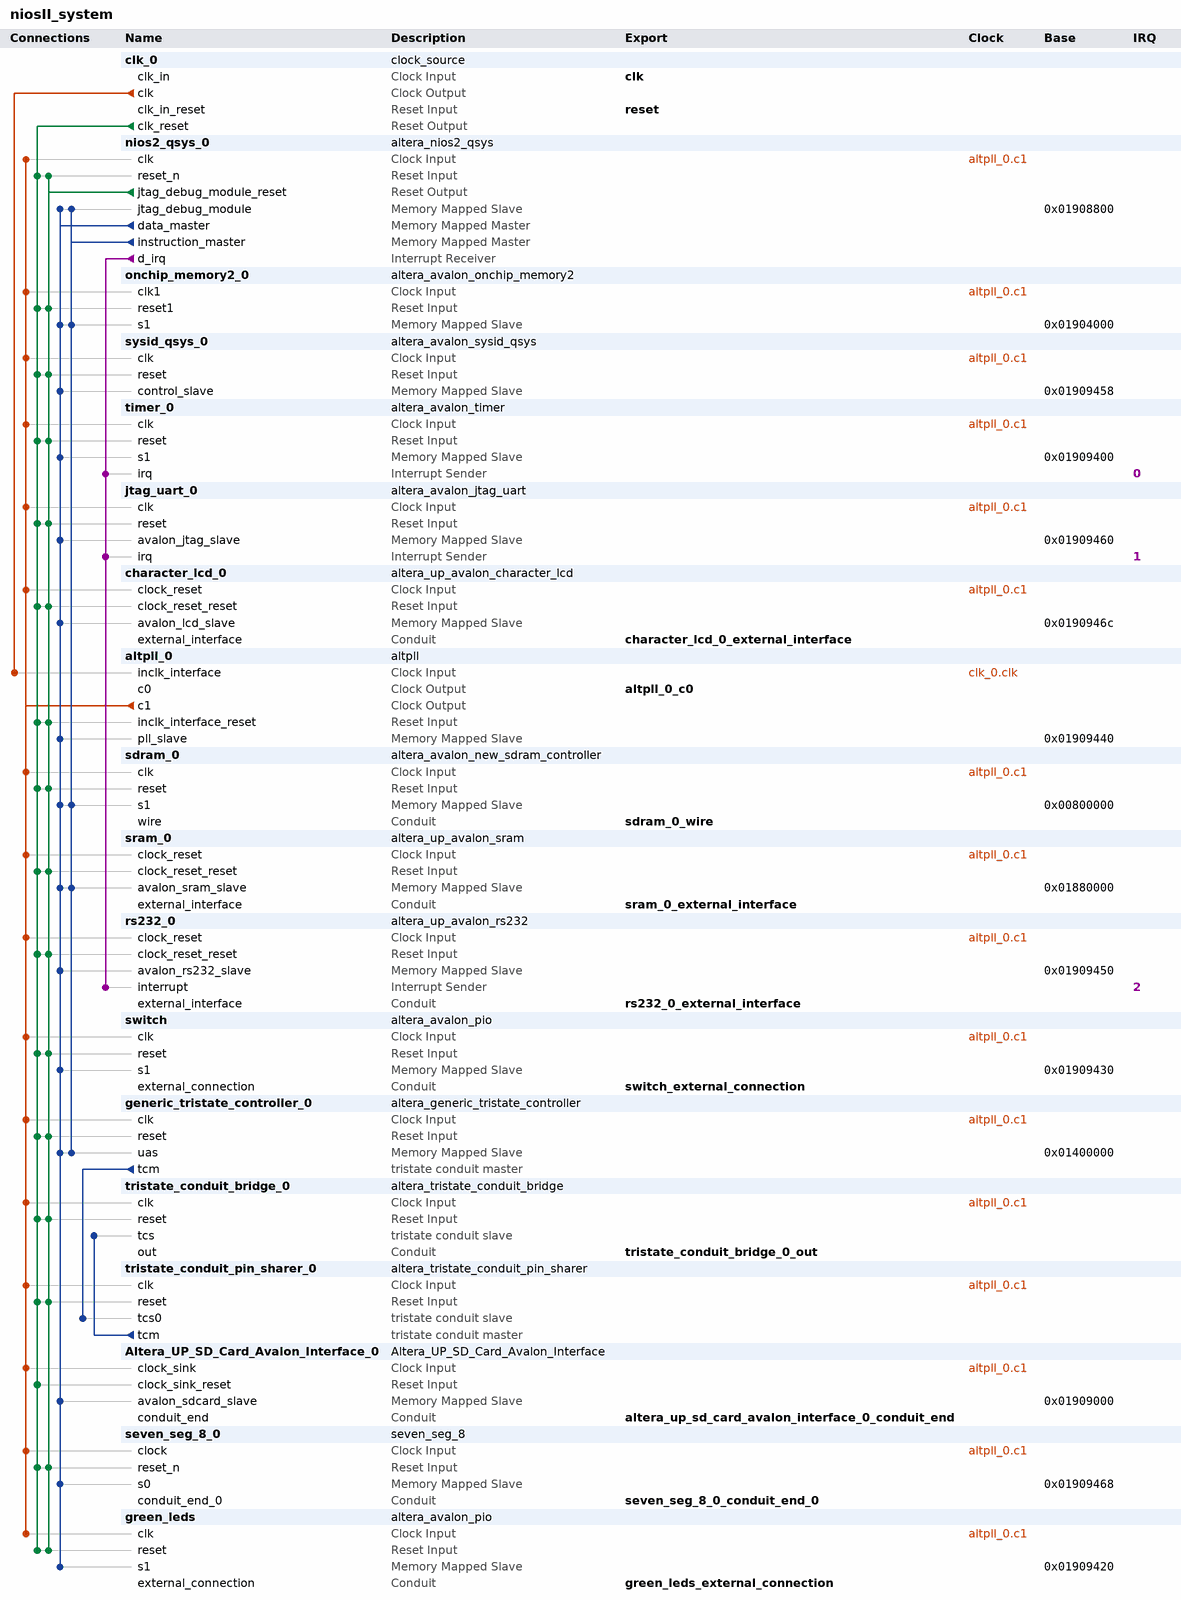
[diagram p0: system contents]
# Platform Designer (Qsys) system niosII_system, Cyclone II EP2C35F672C6
# Parameters at their usual value, and those the tool derives, are not listed.
package require -exact qsys 12.1
create_system niosII_system
set_project_property DEVICE_FAMILY {Cyclone II}
set_project_property DEVICE EP2C35F672C6

add_instance clk_0 clock_source 12.1
set_instance_parameter_value clk_0 clockFrequency 50000000

add_instance nios2_qsys_0 altera_nios2_qsys 12.1
set_instance_parameter_value nios2_qsys_0 resetSlave onchip_memory2_0.s1
set_instance_parameter_value nios2_qsys_0 exceptionSlave onchip_memory2_0.s1
set_instance_parameter_value nios2_qsys_0 breakSlave nios2_qsys_0.jtag_debug_module
set_instance_parameter_value nios2_qsys_0 impl Tiny
set_instance_parameter_value nios2_qsys_0 icache_size 4096

add_instance onchip_memory2_0 altera_avalon_onchip_memory2 12.1
set_instance_parameter_value onchip_memory2_0 dataWidth 32
set_instance_parameter_value onchip_memory2_0 dualPort false
set_instance_parameter_value onchip_memory2_0 initMemContent true
set_instance_parameter_value onchip_memory2_0 initializationFileName onchip_memory2_0
set_instance_parameter_value onchip_memory2_0 memorySize 16384

add_instance sysid_qsys_0 altera_avalon_sysid_qsys 12.1
set_instance_parameter_value sysid_qsys_0 id 0

add_instance timer_0 altera_avalon_timer 12.1
set_instance_parameter_value timer_0 period 1
set_instance_parameter_value timer_0 periodUnits MSEC
set_instance_parameter_value timer_0 timerPreset CUSTOM

add_instance jtag_uart_0 altera_avalon_jtag_uart 12.1
set_instance_parameter_value jtag_uart_0 simInteractiveOptions INTERACTIVE_INPUT_OUTPUT

add_instance character_lcd_0 altera_up_avalon_character_lcd 12.0
set_instance_parameter_value character_lcd_0 cursor Normal

add_instance altpll_0 altpll 12.1
set_instance_parameter_value altpll_0 INCLK0_INPUT_FREQUENCY 20000
set_instance_parameter_value altpll_0 COMPENSATE_CLOCK CLK1
set_instance_parameter_value altpll_0 GATE_LOCK_SIGNAL NO
set_instance_parameter_value altpll_0 VALID_LOCK_MULTIPLIER 1
set_instance_parameter_value altpll_0 INVALID_LOCK_MULTIPLIER 5
set_instance_parameter_value altpll_0 CLK0_MULTIPLY_BY 8
set_instance_parameter_value altpll_0 CLK1_MULTIPLY_BY 8
set_instance_parameter_value altpll_0 CLK0_DIVIDE_BY 5
set_instance_parameter_value altpll_0 CLK1_DIVIDE_BY 5
set_instance_parameter_value altpll_0 CLK0_PHASE_SHIFT -3000
set_instance_parameter_value altpll_0 CLK1_PHASE_SHIFT 0
set_instance_parameter_value altpll_0 CLK1_DUTY_CYCLE 50
set_instance_parameter_value altpll_0 PORT_clk1 PORT_USED
set_instance_parameter_value altpll_0 PORT_clk2 PORT_UNUSED
set_instance_parameter_value altpll_0 PORT_clk3 PORT_UNUSED
set_instance_parameter_value altpll_0 PORT_ARESET PORT_UNUSED
set_instance_parameter_value altpll_0 PORT_LOCKED PORT_UNUSED

add_instance sdram_0 altera_avalon_new_sdram_controller 12.1
set_instance_parameter_value sdram_0 TAC 5.5
set_instance_parameter_value sdram_0 TRCD 20.0
set_instance_parameter_value sdram_0 TRP 20.0
set_instance_parameter_value sdram_0 casLatency 3
set_instance_parameter_value sdram_0 columnWidth 8
set_instance_parameter_value sdram_0 dataWidth 16
set_instance_parameter_value sdram_0 generateSimulationModel false
set_instance_parameter_value sdram_0 model custom
set_instance_parameter_value sdram_0 numberOfBanks 4
set_instance_parameter_value sdram_0 numberOfChipSelects 1
set_instance_parameter_value sdram_0 powerUpDelay 100.0
set_instance_parameter_value sdram_0 refreshPeriod 15.625
set_instance_parameter_value sdram_0 rowWidth 12

add_instance sram_0 altera_up_avalon_sram 12.0
set_instance_parameter_value sram_0 board DE2
set_instance_parameter_value sram_0 pixel_buffer false

add_instance rs232_0 altera_up_avalon_rs232 12.0
set_instance_parameter_value rs232_0 baud 57600
set_instance_parameter_value rs232_0 parity None

add_instance switch altera_avalon_pio 12.1
set_instance_parameter_value switch direction Input
set_instance_parameter_value switch width 1

add_instance generic_tristate_controller_0 altera_generic_tristate_controller 12.1
set_instance_parameter_value generic_tristate_controller_0 TCM_ADDRESS_W 22
set_instance_parameter_value generic_tristate_controller_0 TCM_DATA_W 8
set_instance_parameter_value generic_tristate_controller_0 TCM_BYTEENABLE_W 1
set_instance_parameter_value generic_tristate_controller_0 TCM_READ_WAIT 160
set_instance_parameter_value generic_tristate_controller_0 TCM_WRITE_WAIT 160
set_instance_parameter_value generic_tristate_controller_0 TCM_SETUP_WAIT 40
set_instance_parameter_value generic_tristate_controller_0 TCM_DATA_HOLD 40
set_instance_parameter_value generic_tristate_controller_0 TCM_MAX_PENDING_READ_TRANSACTIONS 3
set_instance_parameter_value generic_tristate_controller_0 TCM_TURNAROUND_TIME 2
set_instance_parameter_value generic_tristate_controller_0 TCM_TIMING_UNITS 0
set_instance_parameter_value generic_tristate_controller_0 TCM_READLATENCY 2
set_instance_parameter_value generic_tristate_controller_0 TCM_SYMBOLS_PER_WORD 1
set_instance_parameter_value generic_tristate_controller_0 USE_READ 1
set_instance_parameter_value generic_tristate_controller_0 USE_BEGINTRANSFER 0
set_instance_parameter_value generic_tristate_controller_0 USE_BYTEENABLE 0
set_instance_parameter_value generic_tristate_controller_0 USE_OUTPUTENABLE 0
set_instance_parameter_value generic_tristate_controller_0 ACTIVE_LOW_READ 1
set_instance_parameter_value generic_tristate_controller_0 ACTIVE_LOW_BYTEENABLE 0
set_instance_parameter_value generic_tristate_controller_0 ACTIVE_LOW_OUTPUTENABLE 0
set_instance_parameter_value generic_tristate_controller_0 ACTIVE_LOW_BEGINTRANSFER 0
set_instance_parameter_value generic_tristate_controller_0 CHIPSELECT_THROUGH_READLATENCY 0
set_instance_parameter_value generic_tristate_controller_0 MODULE_ASSIGNMENT_KEYS embeddedsw.configuration.hwClassnameDriverSupportList,embeddedsw.configuration.isFlash,embeddedsw.configuration.isMemoryDevice,embeddedsw.configuration.isNonVolatileStorage
set_instance_parameter_value generic_tristate_controller_0 MODULE_ASSIGNMENT_VALUES "altera_avalon_lan91c111\\,altera_avalon_cfi_flash,1,1,1"

add_instance tristate_conduit_bridge_0 altera_tristate_conduit_bridge 12.1

add_instance tristate_conduit_pin_sharer_0 altera_tristate_conduit_pin_sharer 12.1
set_instance_parameter_value tristate_conduit_pin_sharer_0 NUM_INTERFACES 1

add_instance Altera_UP_SD_Card_Avalon_Interface_0 Altera_UP_SD_Card_Avalon_Interface 1.0

add_instance seven_seg_8_0 seven_seg_8 1.0

add_instance green_leds altera_avalon_pio 12.1
set_instance_parameter_value green_leds direction Output
set_instance_parameter_value green_leds width 8

# connections
add_connection altpll_0.c1 Altera_UP_SD_Card_Avalon_Interface_0.clock_sink clock
add_connection altpll_0.c1 character_lcd_0.clock_reset clock
add_connection altpll_0.c1 generic_tristate_controller_0.clk clock
add_connection altpll_0.c1 green_leds.clk clock
add_connection altpll_0.c1 jtag_uart_0.clk clock
add_connection altpll_0.c1 nios2_qsys_0.clk clock
add_connection altpll_0.c1 onchip_memory2_0.clk1 clock
add_connection altpll_0.c1 rs232_0.clock_reset clock
add_connection altpll_0.c1 sdram_0.clk clock
add_connection altpll_0.c1 seven_seg_8_0.clock clock
add_connection altpll_0.c1 sram_0.clock_reset clock
add_connection altpll_0.c1 switch.clk clock
add_connection altpll_0.c1 sysid_qsys_0.clk clock
add_connection altpll_0.c1 timer_0.clk clock
add_connection altpll_0.c1 tristate_conduit_bridge_0.clk clock
add_connection altpll_0.c1 tristate_conduit_pin_sharer_0.clk clock
add_connection clk_0.clk altpll_0.inclk_interface clock
add_connection clk_0.clk_reset Altera_UP_SD_Card_Avalon_Interface_0.clock_sink_reset reset
add_connection clk_0.clk_reset altpll_0.inclk_interface_reset reset
add_connection clk_0.clk_reset character_lcd_0.clock_reset_reset reset
add_connection clk_0.clk_reset generic_tristate_controller_0.reset reset
add_connection clk_0.clk_reset green_leds.reset reset
add_connection clk_0.clk_reset jtag_uart_0.reset reset
add_connection clk_0.clk_reset nios2_qsys_0.reset_n reset
add_connection clk_0.clk_reset onchip_memory2_0.reset1 reset
add_connection clk_0.clk_reset rs232_0.clock_reset_reset reset
add_connection clk_0.clk_reset sdram_0.reset reset
add_connection clk_0.clk_reset seven_seg_8_0.reset_n reset
add_connection clk_0.clk_reset sram_0.clock_reset_reset reset
add_connection clk_0.clk_reset switch.reset reset
add_connection clk_0.clk_reset sysid_qsys_0.reset reset
add_connection clk_0.clk_reset timer_0.reset reset
add_connection clk_0.clk_reset tristate_conduit_bridge_0.reset reset
add_connection clk_0.clk_reset tristate_conduit_pin_sharer_0.reset reset
add_connection nios2_qsys_0.jtag_debug_module_reset altpll_0.inclk_interface_reset reset
add_connection nios2_qsys_0.jtag_debug_module_reset character_lcd_0.clock_reset_reset reset
add_connection nios2_qsys_0.jtag_debug_module_reset generic_tristate_controller_0.reset reset
add_connection nios2_qsys_0.jtag_debug_module_reset green_leds.reset reset
add_connection nios2_qsys_0.jtag_debug_module_reset jtag_uart_0.reset reset
add_connection nios2_qsys_0.jtag_debug_module_reset nios2_qsys_0.reset_n reset
add_connection nios2_qsys_0.jtag_debug_module_reset onchip_memory2_0.reset1 reset
add_connection nios2_qsys_0.jtag_debug_module_reset rs232_0.clock_reset_reset reset
add_connection nios2_qsys_0.jtag_debug_module_reset sdram_0.reset reset
add_connection nios2_qsys_0.jtag_debug_module_reset seven_seg_8_0.reset_n reset
add_connection nios2_qsys_0.jtag_debug_module_reset sram_0.clock_reset_reset reset
add_connection nios2_qsys_0.jtag_debug_module_reset switch.reset reset
add_connection nios2_qsys_0.jtag_debug_module_reset sysid_qsys_0.reset reset
add_connection nios2_qsys_0.jtag_debug_module_reset timer_0.reset reset
add_connection nios2_qsys_0.jtag_debug_module_reset tristate_conduit_bridge_0.reset reset
add_connection nios2_qsys_0.jtag_debug_module_reset tristate_conduit_pin_sharer_0.reset reset
add_connection nios2_qsys_0.data_master Altera_UP_SD_Card_Avalon_Interface_0.avalon_sdcard_slave avalon
set_connection_parameter_value nios2_qsys_0.data_master/Altera_UP_SD_Card_Avalon_Interface_0.avalon_sdcard_slave baseAddress 0x01909000
add_connection nios2_qsys_0.data_master altpll_0.pll_slave avalon
set_connection_parameter_value nios2_qsys_0.data_master/altpll_0.pll_slave baseAddress 0x01909440
add_connection nios2_qsys_0.data_master character_lcd_0.avalon_lcd_slave avalon
set_connection_parameter_value nios2_qsys_0.data_master/character_lcd_0.avalon_lcd_slave baseAddress 0x0190946c
add_connection nios2_qsys_0.data_master generic_tristate_controller_0.uas avalon
set_connection_parameter_value nios2_qsys_0.data_master/generic_tristate_controller_0.uas baseAddress 0x01400000
add_connection nios2_qsys_0.data_master green_leds.s1 avalon
set_connection_parameter_value nios2_qsys_0.data_master/green_leds.s1 baseAddress 0x01909420
add_connection nios2_qsys_0.data_master jtag_uart_0.avalon_jtag_slave avalon
set_connection_parameter_value nios2_qsys_0.data_master/jtag_uart_0.avalon_jtag_slave baseAddress 0x01909460
add_connection nios2_qsys_0.data_master nios2_qsys_0.jtag_debug_module avalon
set_connection_parameter_value nios2_qsys_0.data_master/nios2_qsys_0.jtag_debug_module baseAddress 0x01908800
add_connection nios2_qsys_0.data_master onchip_memory2_0.s1 avalon
set_connection_parameter_value nios2_qsys_0.data_master/onchip_memory2_0.s1 baseAddress 0x01904000
add_connection nios2_qsys_0.data_master rs232_0.avalon_rs232_slave avalon
set_connection_parameter_value nios2_qsys_0.data_master/rs232_0.avalon_rs232_slave baseAddress 0x01909450
add_connection nios2_qsys_0.data_master sdram_0.s1 avalon
set_connection_parameter_value nios2_qsys_0.data_master/sdram_0.s1 baseAddress 0x00800000
add_connection nios2_qsys_0.data_master seven_seg_8_0.s0 avalon
set_connection_parameter_value nios2_qsys_0.data_master/seven_seg_8_0.s0 baseAddress 0x01909468
add_connection nios2_qsys_0.data_master sram_0.avalon_sram_slave avalon
set_connection_parameter_value nios2_qsys_0.data_master/sram_0.avalon_sram_slave baseAddress 0x01880000
add_connection nios2_qsys_0.data_master switch.s1 avalon
set_connection_parameter_value nios2_qsys_0.data_master/switch.s1 baseAddress 0x01909430
add_connection nios2_qsys_0.data_master sysid_qsys_0.control_slave avalon
set_connection_parameter_value nios2_qsys_0.data_master/sysid_qsys_0.control_slave baseAddress 0x01909458
add_connection nios2_qsys_0.data_master timer_0.s1 avalon
set_connection_parameter_value nios2_qsys_0.data_master/timer_0.s1 baseAddress 0x01909400
add_connection nios2_qsys_0.instruction_master generic_tristate_controller_0.uas avalon
set_connection_parameter_value nios2_qsys_0.instruction_master/generic_tristate_controller_0.uas baseAddress 0x01400000
add_connection nios2_qsys_0.instruction_master nios2_qsys_0.jtag_debug_module avalon
set_connection_parameter_value nios2_qsys_0.instruction_master/nios2_qsys_0.jtag_debug_module baseAddress 0x01908800
add_connection nios2_qsys_0.instruction_master onchip_memory2_0.s1 avalon
set_connection_parameter_value nios2_qsys_0.instruction_master/onchip_memory2_0.s1 baseAddress 0x01904000
add_connection nios2_qsys_0.instruction_master sdram_0.s1 avalon
set_connection_parameter_value nios2_qsys_0.instruction_master/sdram_0.s1 baseAddress 0x00800000
add_connection nios2_qsys_0.instruction_master sram_0.avalon_sram_slave avalon
set_connection_parameter_value nios2_qsys_0.instruction_master/sram_0.avalon_sram_slave baseAddress 0x01880000
add_connection nios2_qsys_0.d_irq jtag_uart_0.irq interrupt
set_connection_parameter_value nios2_qsys_0.d_irq/jtag_uart_0.irq irqNumber 1
add_connection nios2_qsys_0.d_irq rs232_0.interrupt interrupt
set_connection_parameter_value nios2_qsys_0.d_irq/rs232_0.interrupt irqNumber 2
add_connection nios2_qsys_0.d_irq timer_0.irq interrupt
set_connection_parameter_value nios2_qsys_0.d_irq/timer_0.irq irqNumber 0
add_connection generic_tristate_controller_0.tcm tristate_conduit_pin_sharer_0.tcs0 tristate_conduit
add_connection tristate_conduit_pin_sharer_0.tcm tristate_conduit_bridge_0.tcs tristate_conduit

# exported interfaces
add_interface clk clock sink
set_interface_property clk EXPORT_OF clk_0.clk_in
add_interface reset reset sink
set_interface_property reset EXPORT_OF clk_0.clk_in_reset
add_interface character_lcd_0_external_interface conduit end
set_interface_property character_lcd_0_external_interface EXPORT_OF character_lcd_0.external_interface
add_interface sdram_0_wire conduit end
set_interface_property sdram_0_wire EXPORT_OF sdram_0.wire
add_interface sram_0_external_interface conduit end
set_interface_property sram_0_external_interface EXPORT_OF sram_0.external_interface
add_interface rs232_0_external_interface conduit end
set_interface_property rs232_0_external_interface EXPORT_OF rs232_0.external_interface
add_interface switch_external_connection conduit end
set_interface_property switch_external_connection EXPORT_OF switch.external_connection
add_interface tristate_conduit_bridge_0_out conduit end
set_interface_property tristate_conduit_bridge_0_out EXPORT_OF tristate_conduit_bridge_0.out
add_interface altera_up_sd_card_avalon_interface_0_conduit_end conduit end
set_interface_property altera_up_sd_card_avalon_interface_0_conduit_end EXPORT_OF Altera_UP_SD_Card_Avalon_Interface_0.conduit_end
add_interface seven_seg_8_0_conduit_end_0 conduit end
set_interface_property seven_seg_8_0_conduit_end_0 EXPORT_OF seven_seg_8_0.conduit_end_0
add_interface altpll_0_c0 clock source
set_interface_property altpll_0_c0 EXPORT_OF altpll_0.c0
add_interface green_leds_external_connection conduit end
set_interface_property green_leds_external_connection EXPORT_OF green_leds.external_connection

save_system niosII_system.qsys
